# Altium schematic sheet CAN.SchDoc
size A4; SheetNumber: 3; SheetTotal: 5
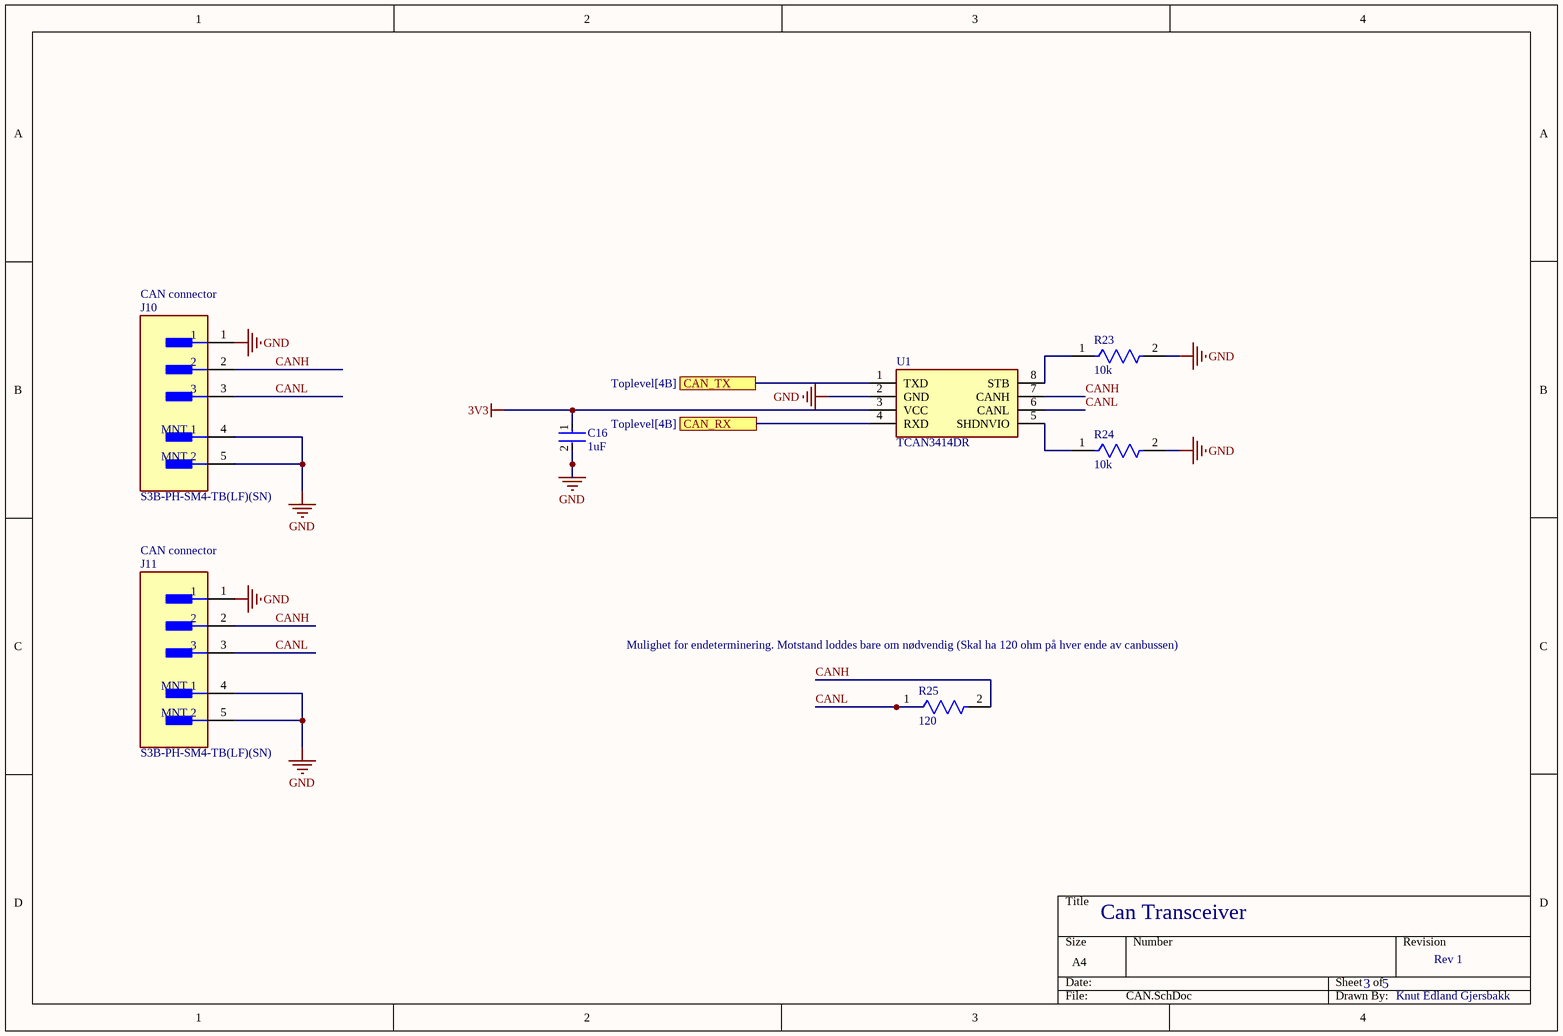
[diagram p0: CAN.SchDoc]

## Parts
C16  1uF  [FP-CL10-IPC_C]
J10  S3B-PH-SM4-TB(LF)(SN)  [FP-S3B-PH-SM4-TB_LF_SN-MFG]
J11  S3B-PH-SM4-TB(LF)(SN)  [FP-S3B-PH-SM4-TB_LF_SN-MFG]
R23  10k  [FP-RT0603-IPC_C]
R24  10k  [FP-RT0603-IPC_C]
R25  120  [FP-AF0603-IPC_C]
U1  TCAN3414DR  [SOIC127P600X175-8N]

## Ports
CAN_RX (see Toplevel[4B]), CAN_TX (see Toplevel[4B])

## Nets
3V3: C16.1 U1.3(VCC)
GND: C16.2 J10.1 J10.4(MNT_1) J10.5(MNT_2) J11.1 J11.4(MNT_1) J11.5(MNT_2) R23.2 R24.2 U1.2(GND)
CAN_RX: U1.4(RXD) ; port CAN_RX
CAN_TX: U1.1(TXD) ; port CAN_TX
CANH: J10.2 J11.2 R25.2 U1.7(CANH)
CANL: J10.3 J11.3 R25.1 U1.6(CANL)
NetR23_1: R23.1 U1.8(STB)
NetR24_1: R24.1 U1.5(SHDNVIO)

## Notes on the sheet
- (near J10) CAN connector
- (near J11) CAN connector
- Mulighet for endeterminering. Motstand loddes bare om nødvendig (Skal ha 120 ohm på hver ende av canbussen)
- Can Transceiver
- 3
- 5
- Rev 1
- Knut Edland Gjersbakk

## Library data of the parts
C16 = CMP-13271-000784-1: Cap Ceramic 1uF 16V X7R ±10% Pad SMD 0603 +125°C T/R / CL10B105KO8NNNL; Mount: Surface Mount; Case/Package: 0603; Capacitance: 1uF; Package Quantity: 15000; Tolerance: 10%; Height: 0.8mm; Thickness: 0.035inch; Length: 1.6mm; Lead Free: Lead Free; Depth: 0.8mm; Radiation Hardening: No; Voltage Rating: 16V; Max Operating Temperature: 125°C; Min Operating Temperature: -55°C; Dielectric: X7R; Voltage Rating (DC): 16V; Packaging: Tape and Reel; Width: 0.031inch
J10 J11 = CMP-002-00113-1: Connector Header, PH Series, 3 Position, Side Entry, 2.00mm, Solder, Surface Mount, Natural.; Voltage Rating: 100V; Max Current Rating: 2A; Connector Type: Male Pin; Gender: Male; Max Operating Temperature: 85°C; Mounting Technology: Surface Mount; Pins: 3; Min Operating Temperature: -25°C
R23 R24 = CMP-03412-005349-1: RES SMD 10K OHM 1% 1/10W 0603 / RT0603FRE0710KL; Manufacturer: Yageo; Value: 10KΩ; Temperature Coefficient: 50 ppm/°C; Power Rating: 0.1W; Tolerance: 0.01; Voltage Rating: 75V; RoHS: TRUE; Category: Res; Automotive: No; Digikey Description: RES SMD 10K OHM 1% 1/10W 0603; ComponentLink2Description: Datasheet; Octopart: https://octopart.com/rt0603fre0710kl-yageo-40009243; ComponentLink2URL: http://www.yageo.com/documents/recent/PYu-RT_1-to-0.01_RoHS_L_9.pdf; Device Class L3: Chip SMD Resistors; Device Class L1: Passive Components; Temperature Range High: +155°C; Height: 0.55mm; Composition: Thin Film; Ipc Land Pattern Name: RESC16080X45; Series: RT; Package: RT0603; Resistance: 10KΩ; Footprint Url: http://www.yageo.com/exep/pages/download/literatures/PYu-R_Mount_10.pdf; Temperature: -55°C to +155°C; Temperature Range Low: -55°C; Lead Free: Yes; Device Class L2: Resistors; Mouser Description: Thin Film Resistors - SMD 10K ohm 1% 1/10W; Manufacturer Part Number: RT0603FRE0710KL
R25 = CMP-03412-039700-1: Anti-Sulfurated Chip Resistors Automotive Grade 120Ω 1% 100ppm/°C 0603 AF0603FR-07120RL; Max Power Dissipation: 100mW; Resistance: 120R; Min Operating Temperature: -55°C; Tolerance: 1%; RoHS Compliant: Yes; Number of Terminations: 2; Height: 0.022inch; Series: AF; Length: 0.063inch; Width: 0.031inch; Resistor Type: Thick Film; Max Operating Temperature: 155°C; Case/Package: 0603; Packaging: Tape and Reel; Features: Moisture Resistant; Temperature Coefficient: 100ppm/°C
U1 = TCAN3414DR: Integrated Circuit; Manufacturer_Name: Texas Instruments; Datasheet Link: https://www.ti.com/lit/ds/symlink/tcan3414.pdf?ts=1713723144569&ref_url=https%253A%252F%252Fwww.mouser.ch%252F; Height: 1.75mm; Manufacturer_Part_Number: TCAN3414DR; Mouser Part Number: 595-TCAN3414DR; Mouser Price/Stock: https://www.mouser.co.uk/ProductDetail/Texas-Instruments/TCAN3414DR?qs=mELouGlnn3egF2AojRJddw%3D%3D; Arrow Part Number: TCAN3414DR; Arrow Price/Stock: https://www.arrow.com/en/products/tcan3414dr/texas-instruments?region=nac